# Altium schematic sheet 74HC595.SchDoc
size A4
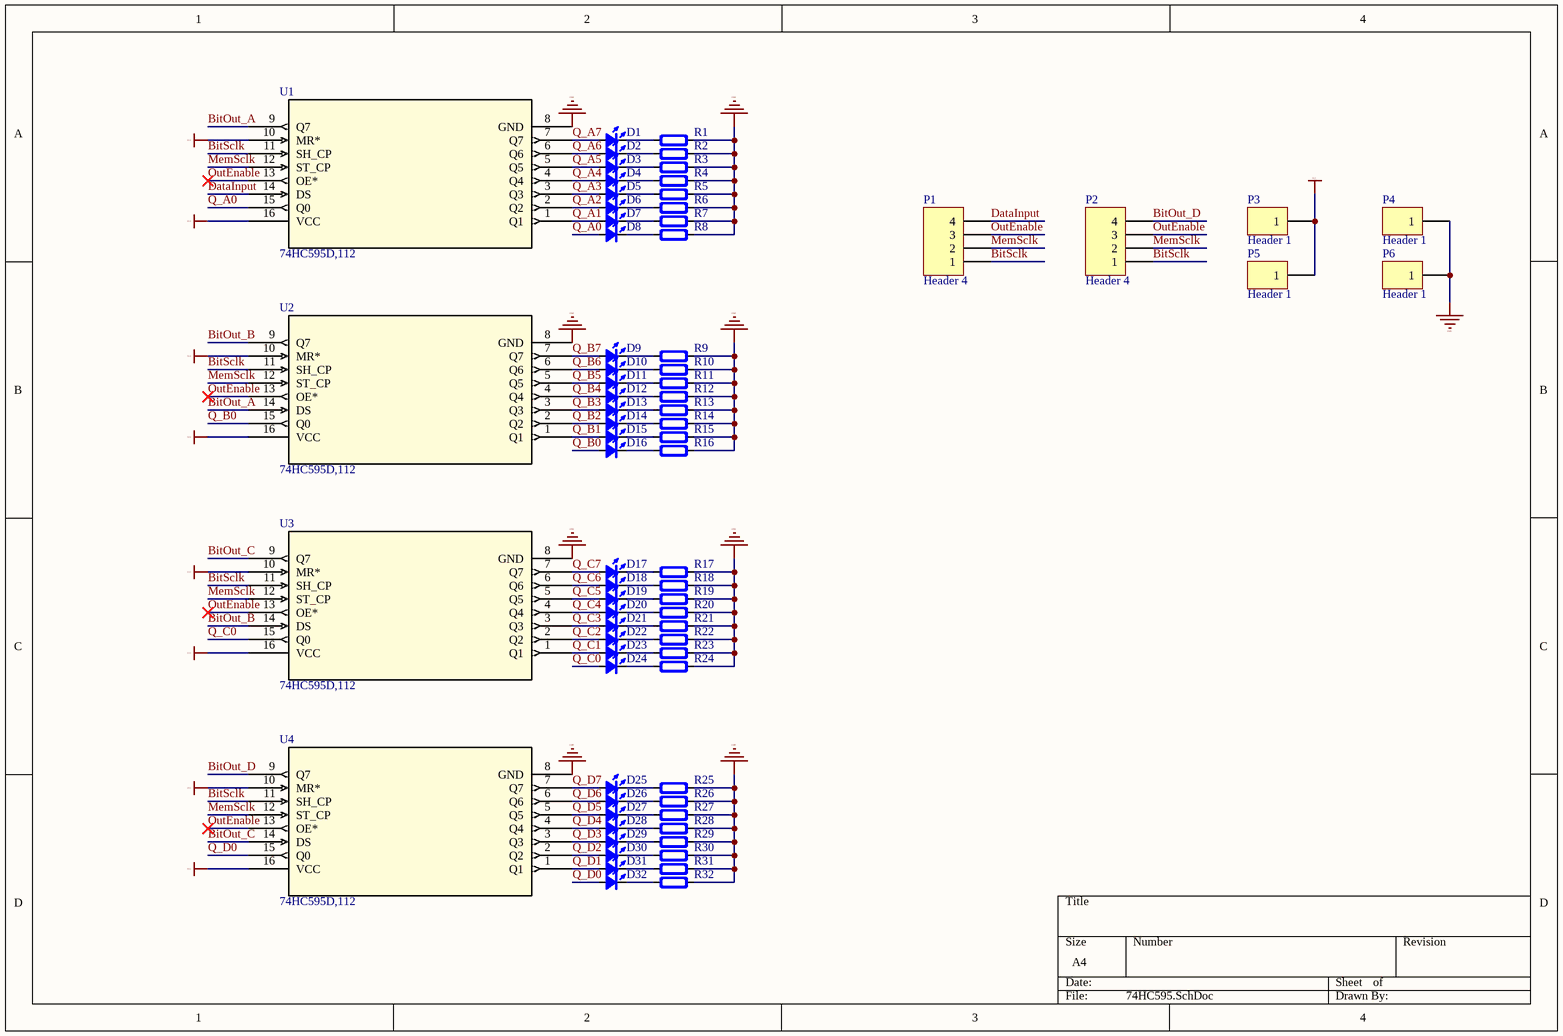
[diagram p0: 74HC595.SchDoc]

## Parts
D1  color?  [LED_0805_RED]  (value not drawn)
D2  color?  [LED_0805_RED]  (value not drawn)
D3  color?  [LED_0805_RED]  (value not drawn)
D4  color?  [LED_0805_RED]  (value not drawn)
D5  color?  [LED_0805_RED]  (value not drawn)
D6  color?  [LED_0805_RED]  (value not drawn)
D7  color?  [LED_0805_RED]  (value not drawn)
D8  color?  [LED_0805_RED]  (value not drawn)
D9  color?  [LED_0805_RED]  (value not drawn)
D10  color?  [LED_0805_RED]  (value not drawn)
D11  color?  [LED_0805_RED]  (value not drawn)
D12  color?  [LED_0805_RED]  (value not drawn)
D13  color?  [LED_0805_RED]  (value not drawn)
D14  color?  [LED_0805_RED]  (value not drawn)
D15  color?  [LED_0805_RED]  (value not drawn)
D16  color?  [LED_0805_RED]  (value not drawn)
D17  color?  [LED_0805_RED]  (value not drawn)
D18  color?  [LED_0805_RED]  (value not drawn)
D19  color?  [LED_0805_RED]  (value not drawn)
D20  color?  [LED_0805_RED]  (value not drawn)
D21  color?  [LED_0805_RED]  (value not drawn)
D22  color?  [LED_0805_RED]  (value not drawn)
D23  color?  [LED_0805_RED]  (value not drawn)
D24  color?  [LED_0805_RED]  (value not drawn)
D25  color?  [LED_0805_RED]  (value not drawn)
D26  color?  [LED_0805_RED]  (value not drawn)
D27  color?  [LED_0805_RED]  (value not drawn)
D28  color?  [LED_0805_RED]  (value not drawn)
D29  color?  [LED_0805_RED]  (value not drawn)
D30  color?  [LED_0805_RED]  (value not drawn)
D31  color?  [LED_0805_RED]  (value not drawn)
D32  color?  [LED_0805_RED]  (value not drawn)
P1  Header 4  [HDR1X4_SOP]
P2  Header 4  [HDR1X4_SOP]
P3  Header 1  [HDR1X1_SOP]
P4  Header 1  [HDR1X1_SOP]
P5  Header 1  [HDR1X1_SOP]
P6  Header 1  [HDR1X1_SOP]
R1  R0805  [RES_0805]  (value not drawn)
R2  R0805  [RES_0805]  (value not drawn)
R3  R0805  [RES_0805]  (value not drawn)
R4  R0805  [RES_0805]  (value not drawn)
R5  R0805  [RES_0805]  (value not drawn)
R6  R0805  [RES_0805]  (value not drawn)
R7  R0805  [RES_0805]  (value not drawn)
R8  R0805  [RES_0805]  (value not drawn)
R9  R0805  [RES_0805]  (value not drawn)
R10  R0805  [RES_0805]  (value not drawn)
R11  R0805  [RES_0805]  (value not drawn)
R12  R0805  [RES_0805]  (value not drawn)
R13  R0805  [RES_0805]  (value not drawn)
R14  R0805  [RES_0805]  (value not drawn)
R15  R0805  [RES_0805]  (value not drawn)
R16  R0805  [RES_0805]  (value not drawn)
R17  R0805  [RES_0805]  (value not drawn)
R18  R0805  [RES_0805]  (value not drawn)
R19  R0805  [RES_0805]  (value not drawn)
R20  R0805  [RES_0805]  (value not drawn)
R21  R0805  [RES_0805]  (value not drawn)
R22  R0805  [RES_0805]  (value not drawn)
R23  R0805  [RES_0805]  (value not drawn)
R24  R0805  [RES_0805]  (value not drawn)
R25  R0805  [RES_0805]  (value not drawn)
R26  R0805  [RES_0805]  (value not drawn)
R27  R0805  [RES_0805]  (value not drawn)
R28  R0805  [RES_0805]  (value not drawn)
R29  R0805  [RES_0805]  (value not drawn)
R30  R0805  [RES_0805]  (value not drawn)
R31  R0805  [RES_0805]  (value not drawn)
R32  R0805  [RES_0805]  (value not drawn)
U1  74HC595D,112  [SOT109-1_NEX]
U2  74HC595D,112  [SOT109-1_NEX]
U3  74HC595D,112  [SOT109-1_NEX]
U4  74HC595D,112  [SOT109-1_NEX]

## Nets
GND: P4.1 P6.1 R1.2 R2.2 R3.2 R4.2 R5.2 R6.2 R7.2 R8.2 R9.2 R10.2 R11.2 R12.2 R13.2 R14.2 R15.2 R16.2 R17.2 R18.2 R19.2 R20.2 R21.2 R22.2 R23.2 R24.2 R25.2 R26.2 R27.2 R28.2 R29.2 R30.2 R31.2 R32.2 U1.8(GND) U2.8(GND) U3.8(GND) U4.8(GND)
VCC: P3.1 P5.1 U1.10(MR*) U1.16(VCC) U2.10(MR*) U2.16(VCC) U3.10(MR*) U3.16(VCC) U4.10(MR*) U4.16(VCC)
BitOut_A: U1.9(Q7) U2.14(DS)
BitOut_B: U2.9(Q7) U3.14(DS)
BitOut_C: U3.9(Q7) U4.14(DS)
BitOut_D: P2.4 U4.9(Q7)
BitSclk: P1.1 P2.1 U1.11(SH_CP) U2.11(SH_CP) U3.11(SH_CP) U4.11(SH_CP)
DataInput: P1.4 U1.14(DS)
MemSclk: P1.2 P2.2 U1.12(ST_CP) U2.12(ST_CP) U3.12(ST_CP) U4.12(ST_CP)
OutEnable: P1.3 P2.3 U1.13(OE*) U2.13(OE*) U3.13(OE*) U4.13(OE*)
Q_A0: D8.2(A) U1.15(Q0)
Q_A1: D7.2(A) U1.1(Q1)
Q_A2: D6.2(A) U1.2(Q2)
Q_A3: D5.2(A) U1.3(Q3)
Q_A4: D4.2(A) U1.4(Q4)
Q_A5: D3.2(A) U1.5(Q5)
Q_A6: D2.2(A) U1.6(Q6)
Q_A7: D1.2(A) U1.7(Q7)
Q_B0: D16.2(A) U2.15(Q0)
Q_B1: D15.2(A) U2.1(Q1)
Q_B2: D14.2(A) U2.2(Q2)
Q_B3: D13.2(A) U2.3(Q3)
Q_B4: D12.2(A) U2.4(Q4)
Q_B5: D11.2(A) U2.5(Q5)
Q_B6: D10.2(A) U2.6(Q6)
Q_B7: D9.2(A) U2.7(Q7)
Q_C0: D24.2(A) U3.15(Q0)
Q_C1: D23.2(A) U3.1(Q1)
Q_C2: D22.2(A) U3.2(Q2)
Q_C3: D21.2(A) U3.3(Q3)
Q_C4: D20.2(A) U3.4(Q4)
Q_C5: D19.2(A) U3.5(Q5)
Q_C6: D18.2(A) U3.6(Q6)
Q_C7: D17.2(A) U3.7(Q7)
Q_D0: D32.2(A) U4.15(Q0)
Q_D1: D31.2(A) U4.1(Q1)
Q_D2: D30.2(A) U4.2(Q2)
Q_D3: D29.2(A) U4.3(Q3)
Q_D4: D28.2(A) U4.4(Q4)
Q_D5: D27.2(A) U4.5(Q5)
Q_D6: D26.2(A) U4.6(Q6)
Q_D7: D25.2(A) U4.7(Q7)
NetD1_1: D1.1(K) R1.1
NetD2_1: D2.1(K) R2.1
NetD3_1: D3.1(K) R3.1
NetD4_1: D4.1(K) R4.1
NetD5_1: D5.1(K) R5.1
NetD6_1: D6.1(K) R6.1
NetD7_1: D7.1(K) R7.1
NetD8_1: D8.1(K) R8.1
NetD9_1: D9.1(K) R9.1
NetD10_1: D10.1(K) R10.1
NetD11_1: D11.1(K) R11.1
NetD12_1: D12.1(K) R12.1
NetD13_1: D13.1(K) R13.1
NetD14_1: D14.1(K) R14.1
NetD15_1: D15.1(K) R15.1
NetD16_1: D16.1(K) R16.1
NetD17_1: D17.1(K) R17.1
NetD18_1: D18.1(K) R18.1
NetD19_1: D19.1(K) R19.1
NetD20_1: D20.1(K) R20.1
NetD21_1: D21.1(K) R21.1
NetD22_1: D22.1(K) R22.1
NetD23_1: D23.1(K) R23.1
NetD24_1: D24.1(K) R24.1
NetD25_1: D25.1(K) R25.1
NetD26_1: D26.1(K) R26.1
NetD27_1: D27.1(K) R27.1
NetD28_1: D28.1(K) R28.1
NetD29_1: D29.1(K) R29.1
NetD30_1: D30.1(K) R30.1
NetD31_1: D31.1(K) R31.1
NetD32_1: D32.1(K) R32.1

## Library data of the parts
D1-D32 = LED_0805: LED; Type: 0805; Value: color?
P1 P2 = Header 4: Header, 4-Pin; LatestRevisionDate: 17-Jul-2002; LatestRevisionNote: Re-released for DXP Platform.; Publisher: Altium Limited
P3-P6 = Header 1: Header, 1-Pin; LatestRevisionDate: 17-Jul-2002; LatestRevisionNote: Re-released for DXP Platform.; Publisher: Altium Limited
R1-R32 = Res_0805: Resistor; Specification: ±5%; Value: 1K; Manufacturer: *; Type: 0805
U1-U4 = 74HC595D,112: No Description Available; Vendor: Nexperia; SourceLibrary: Nexperia_2018-05-2018; Manufacturer_Part_Number: 74HC595D,112; Copyright: Copyright (C) 2016 Accelerated Designs. All rights reserved; RefDes: RefDes; Type: DEV